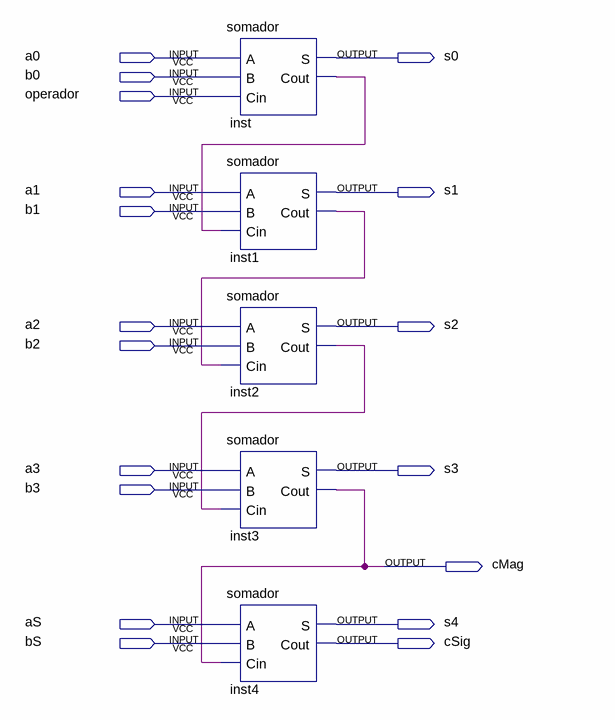
[diagram p0: schematic sheet]
// Quartus schematic somador5.bdf as structural Verilog: 5 symbols, 18 pins
module somador5 (
  input  a0,
  input  b0,
  input  operador,
  input  a1,
  input  b1,
  input  a2,
  input  b2,
  input  a3,
  input  b3,
  input  aS,
  input  bS,
  output s0,
  output s1,
  output s2,
  output s3,
  output cMag,
  output s4,
  output cSig
);

  wire inst1_cout, inst2_cout, inst_cout;

  somador inst (.A(a0), .B(b0), .Cin(operador), .S(s0), .Cout(inst_cout));
  somador inst1 (.A(a1), .B(b1), .Cin(inst_cout), .S(s1), .Cout(inst1_cout));
  somador inst2 (.A(a2), .B(b2), .Cin(inst1_cout), .S(s2), .Cout(inst2_cout));
  somador inst3 (.A(a3), .B(b3), .Cin(inst2_cout), .S(s3), .Cout(cMag));
  somador inst4 (.A(aS), .B(bS), .Cin(cMag), .S(s4), .Cout(cSig));
endmodule
